# EAGLE design DX (EAGLE 5.07)
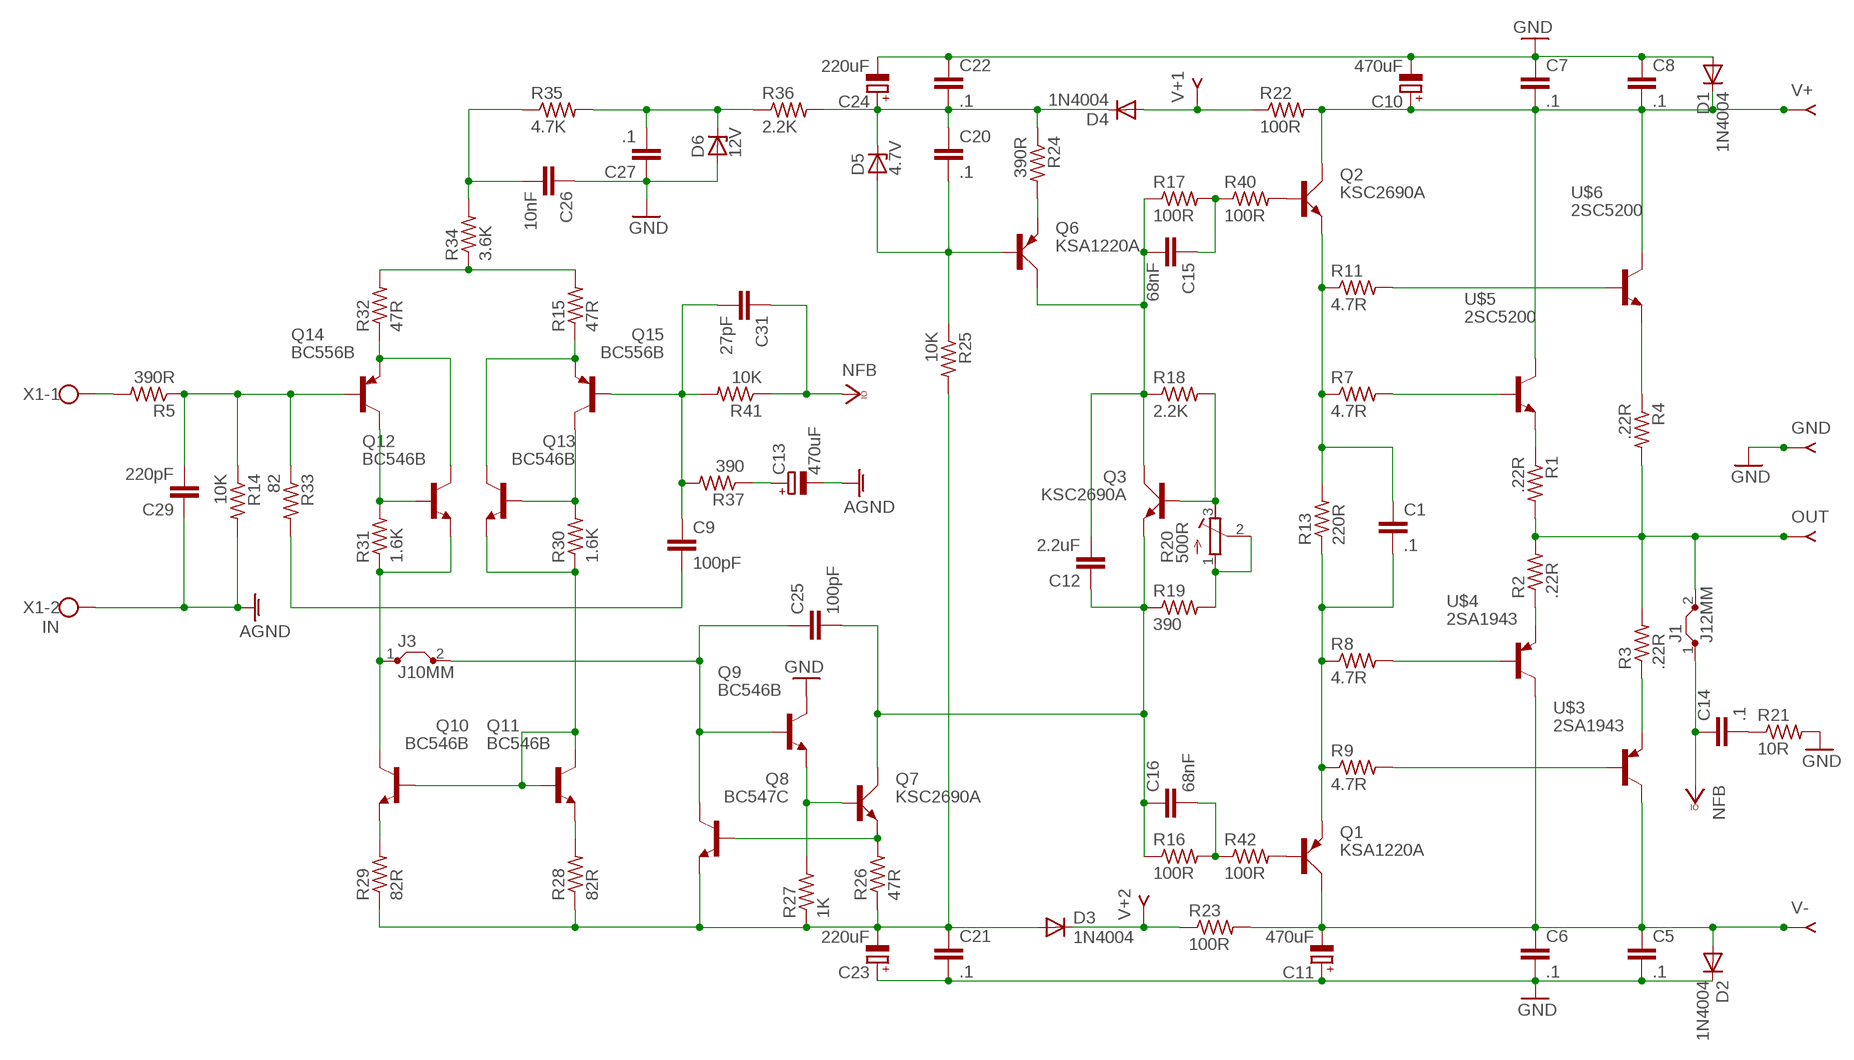
[diagram p0: schematic, sheet 1]

## Parts
C1  .1  C-EU102-043X133  [C102-043X133]
C5  .1  C-EU102-043X133  [C102-043X133]
C6  .1  C-EU102-043X133  [C102-043X133]
C7  .1  C-EU102-043X133  [C102-043X133]
C8  .1  C-EU102-043X133  [C102-043X133]
C9  100pF  C-EU102-043X133  [C102-043X133]
C10  470uF  CPOL-EUE7.5-18  [E7,5-18]
C11  470uF  CPOL-EUE7.5-18  [E7,5-18]
C12  2.2uF  C-EU102-043X133  [C102-043X133]
C13  470uF  CPOL-EUE5-13  [E5-13]
C14  .1  C-EU102-043X133  [C102-043X133]
C15  68nF  C-EU102-043X133  [C102-043X133]
C16  68nF  C-EU102-043X133  [C102-043X133]
C20  .1  C-EU102-043X133  [C102-043X133]
C21  .1  C-EU102-043X133  [C102-043X133]
C22  .1  C-EU102-043X133  [C102-043X133]
C23  220uF  CPOL-EUE5-13  [E5-13]
C24  220uF  CPOL-EUE5-13  [E5-13]
C25  100pF  C-EU102-043X133  [C102-043X133]
C26  10nF  C-EU050-030X075  [C050-030X075]
C27  .1  C-EU102-043X133  [C102-043X133]
C29  220pF  C-EU050-030X075  [C050-030X075]
C31  27pF  C-EU102-043X133  [C102-043X133]
D1  1N4004  [DO41-10]
D2  1N4004  [DO41-10]
D3  1N4004  [DO41-10]
D4  1N4004  [DO41-10]
D5  4.7V  BZX90  [DO34Z7]
D6  12V  BZX90  [DO34Z7]
GND  GND  QFIT  [FASTON]
J1  J12MM  [12]
J3  J10MM  [10]
OUT  QFIT  [FASTON]
Q1  KSA1220A  BD140  [TO126AV]
Q2  KSC2690A  BD139  [TO126AV]
Q3  KSC2690A  BD139  [TO126AV]
Q6  KSA1220A  BD140  [TO126AV]
Q7  KSC2690A  BD139  [TO126AV]
Q8  BC547C  BC547B-NPN-TO92-EBC  [TO92-EBC]
Q9  BC546B  BC546A  [TO92-EBC]
Q10  BC546B  BC546A  [TO92-EBC]
Q11  BC546B  BC546A  [TO92-EBC]
Q12  BC546B  BC546A  [TO92-EBC]
Q13  BC546B  BC546A  [TO92-EBC]
Q14  BC556B  BC556  [TO92-EBC]
Q15  BC556B  BC556  [TO92-EBC]
R1  .22R  R-US_0617/22  [0617/22]
R2  .22R  R-US_0617/22  [0617/22]
R3  .22R  R-US_0617/22  [0617/22]
R4  .22R  R-US_0617/22  [0617/22]
R5  390R  R-US_0309/12  [0309/12]
R7  4.7R  R-US_0309/12  [0309/12]
R8  4.7R  R-US_0309/12  [0309/12]
R9  4.7R  R-US_0309/12  [0309/12]
R11  4.7R  R-US_0309/12  [0309/12]
R13  220R  R-US_0309/12  [0309/12]
R14  10K  R-US_0309/12  [0309/12]
R15  47R  R-US_0309/12  [0309/12]
R16  100R  R-US_0309/12  [0309/12]
R17  100R  R-US_0309/12  [0309/12]
R18  2.2K  R-US_0309/12  [0309/12]
R19  390  R-US_0309/12  [0309/12]
R20  500R  R-TRIMM3299W  [RTRIM3299W]
R21  10R  R-US_0309/12  [0309/12]
R22  100R  R-US_0309/12  [0309/12]
R23  100R  R-US_0309/12  [0309/12]
R24  390R  R-US_0309/12  [0309/12]
R25  10K  R-US_0617/22  [0617/22]
R26  47R  R-US_0309/12  [0309/12]
R27  1K  R-US_0309/12  [0309/12]
R28  82R  R-US_0309/12  [0309/12]
R29  82R  R-US_0309/12  [0309/12]
R30  1.6K  R-US_0309/12  [0309/12]
R31  1.6K  R-US_0309/12  [0309/12]
R32  47R  R-US_0309/12  [0309/12]
R33  82  R-US_0309/12  [0309/12]
R34  3.6K  R-US_0309/12  [0309/12]
R35  4.7K  R-US_0309/12  [0309/12]
R36  2.2K  R-US_0309/12  [0309/12]
R37  390  R-US_0309/12  [0309/12]
R40  100R  R-US_0309/12  [0309/12]
R41  10K  R-US_0309/12  [0309/12]
R42  100R  R-US_0309/12  [0309/12]
U$3  2SA1943  MJL4302  [TO-264]
U$4  2SA1943  MJL4302  [TO-264]
U$5  2SC5200  MJL4281  [TO-264]
U$6  2SC5200  MJL4281  [TO-264]
V+  QFIT  [FASTON]
V+1  QFIT  [FASTON]
V+2  QFIT  [FASTON]
V-  QFIT  [FASTON]
X1  IN  W237-102  [W237-102]

## Nets
AGND: C13.- C29.1 R14.2 X1.2
GND: C5.2 C6.2 C7.1 C8.1 C10.- C11.+ C21.2 C22.1 C23.+ C24.- C26.1 C27.1 D1.A D2.C D6.A GND.1 GND.2 Q9.C R21.2
N$1: R1.1 U$5.E
N$2: R2.1 U$4.E
N$3: R3.1 U$3.E
N$4: R4.1 U$6.E
N$5: R11.2 U$6.B
N$6: C15.1 R17.2 R40.1
N$7: R7.2 U$5.B
N$8: R8.2 U$4.B
N$9: R9.2 U$3.B
N$10: Q2.B R40.2
N$11: D3.C R23.1 V+2.1 V+2.2
N$12: D4.A R22.1 V+1.1 V+1.2
N$15: C12.1 C16.1 C25.2 Q3.E Q7.C R16.1 R19.1
N$16: C9.2 R33.2
N$17: C29.2 Q14.B R5.1 R14.1 R33.1
N$18: C1.2 Q1.E R8.1 R9.1 R13.1
N$19: C1.1 Q2.E R7.1 R11.1 R13.2
N$20: R5.2 X1.1
N$21: R19.2 R20.1(E) R20.2(S)
N$25: Q3.B R18.2 R20.3(A)
N$28: C7.2 C8.2 C10.+ D1.C Q2.C R22.2 U$5.C U$6.C V+.1 V+.2
N$30: C20.2 D5.A Q6.B R25.1
N$31: C12.2 C15.2 Q3.C Q6.C R17.1 R18.1
N$34: C21.1 C23.- D3.A Q8.E R25.2 R26.1 R27.1 R28.1 R29.1
N$35: C20.1 C22.2 C24.+ D4.C D5.C R24.1 R36.2
N$36: Q6.E R24.2
N$38: Q11.E R28.2
N$39: C26.2 R34.2 R35.1
N$40: Q7.B Q9.E R27.2
N$41: Q7.E Q8.B R26.2
N$42: C25.1 J3.2 Q8.C Q9.B
N$43: Q10.E R29.2
N$44: Q13.C Q15.E R15.1
N$45: Q12.B Q14.C R31.2
N$46: Q10.B Q11.B Q11.C Q13.E R30.1
N$47: Q12.C Q14.E R32.1
N$48: J1.2 OUT.1 OUT.2 R1.2 R2.2 R3.2 R4.2
N$49: R15.2 R32.2 R34.1
N$51: C27.2 D6.C R35.2 R36.1
N$52: C5.1 C6.1 C11.- D2.A Q1.C R23.2 U$3.C U$4.C V-.1 V-.2
N$53: C13.+ R37.1
N$54: Q13.B Q15.C R30.2
N$55: C9.1 C31.2 Q15.B R37.2 R41.2
N$58: C14.2 R21.1
N$59: C16.2 R16.2 R42.1
N$60: J3.1 Q10.C Q12.E R31.1
N$61: Q1.B R42.2
VCCIO: C14.1 C31.1 J1.1 R41.1 ; supply symbol labelled NFB

## Library data of the parts
C1 C5-C9 C12 C14-C16 C20-C22 C25-C27 C29 C31 = resistor:C-EU: CAPACITOR, European symbol
C10 C11 C13 C23 C24 = resistor:CPOL-EU: POLARIZED CAPACITOR, European symbol
D1-D4 = diode:1N4004: DIODE general purpose rectifier, 1 A
D5 D6 = diode:BZX90: Z DIODE
GND OUT V+ V+1 V+2 V- = keystone:QFIT: QUICKFIT PCB TERMINAL
J1 J3 = jumper:J: Bridge
Q1 Q6 = transistor-power:BD140: PNP TRANSISTOR
Q2 Q3 Q7 = transistor-power:BD139: NPN TRANSISTOR
Q8 = transistor:*-NPN-: NPN Transistror BF959 corrected 2008.03.06
Q9-Q13 = transistor-npn:BC546*: NPN Transistor
Q14 Q15 = transistor-pnp:BC556*: PNP Transistror
R1-R5 R7-R9 R11 R13-R19 R21-R37 R40-R42 = resistor:R-US_: RESISTOR, American symbol
R20 = resistor:R-TRIMM: Trimm resistor
U$3 U$4 = Rudi_TO264:MJL4302: MJL4302 PNP BCE TO-264
U$5 U$6 = Rudi_TO264:MJL4281: MJL4281 NPN BCE TO-264
X1 = con-wago-500:W237-102: WAGO SCREW CLAMP

## Board
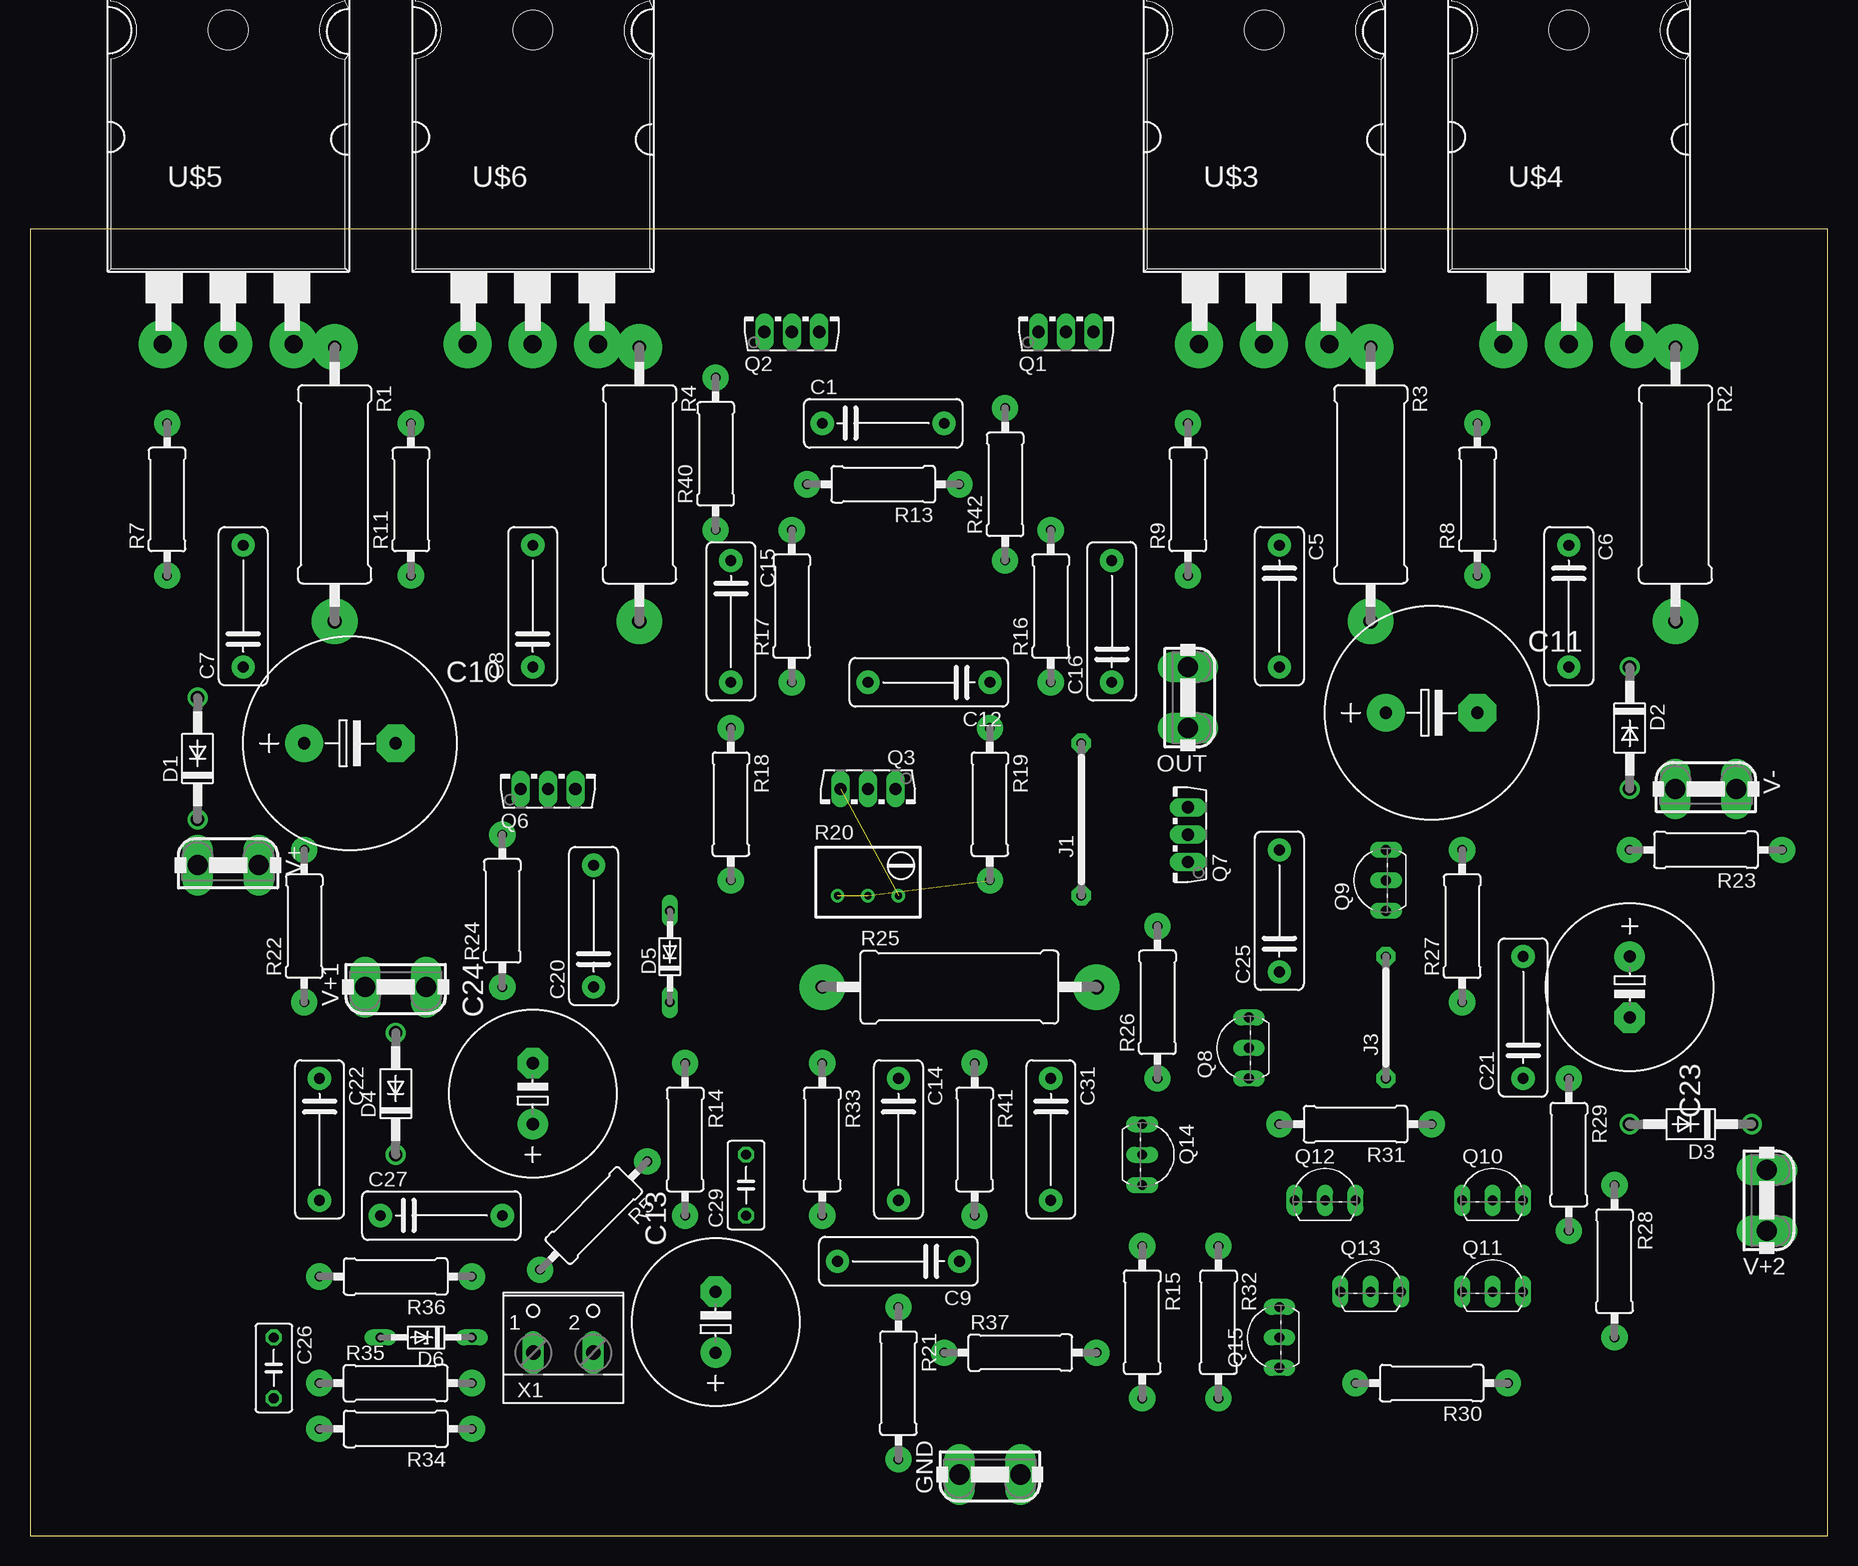
[diagram p1: board, top side]
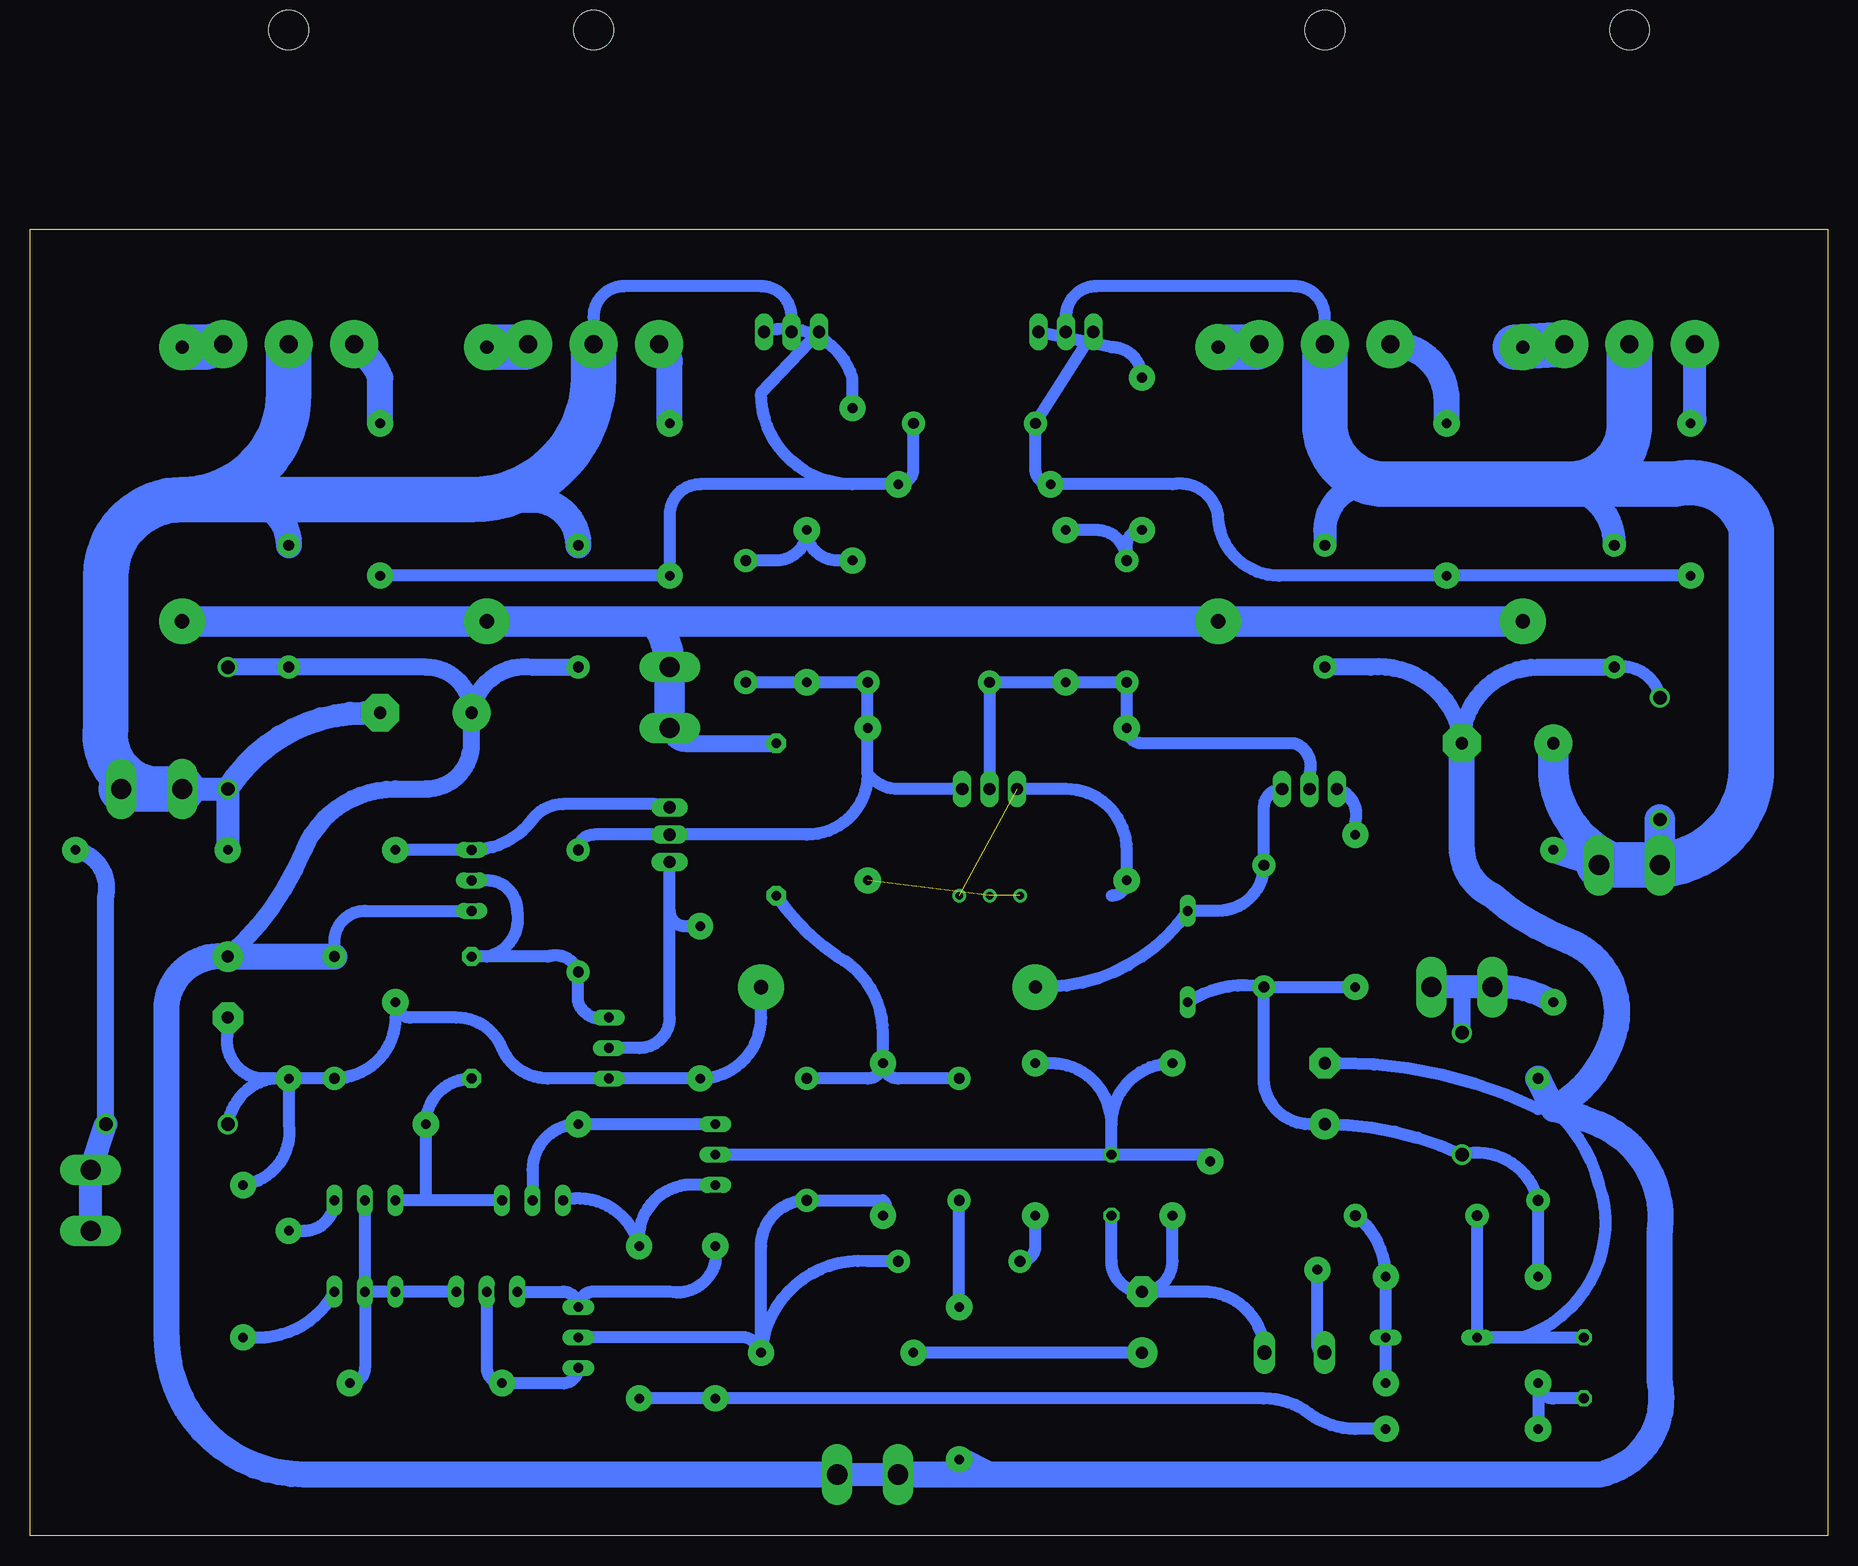
[diagram p2: board, bottom side, seen from below]

Size 149.84 x 108.89 mm. Coordinates in mm from the lower left corner, seen from the top.
Outline: 0,0 149.84,0 149.84,108.89 0,108.89 0,0
Copper layers (1*16): Top 0.035mm / dielectric 1.5mm / Bottom 0.035mm
Design rules "default *": minimum track width 10mil, minimum drill 30mil, track to track 8mil, track to pad 8mil, pad to pad 8mil, via to via 8mil, smd to smd 8mil, copper to edge 40mil, drill to drill 8mil, minimum pad ring 10mil, minimum via ring 8mil, stop-mask expansion 4mil, vias tented up to drill 0mil, thermal gap 10mil
Holes 0.6 mm at -33.02,2.54 -33.02,114.3 180.34,114.3

### Footprints (pad centres in the part's own frame; a part is rotated, then mirrored left to right if it is on the bottom)
C102-043X133 = drill 0.9 pad 1.93 round: 1 -5.08,0; 2 5.08,0
E7,5-18 = drill 1.016 pad 3.15 round: + -3.81,0 | drill 1.016 pad 3.15 octagon: - 3.81,0
E5-13 = drill 1.016 pad 2.54 round: + -2.54,0 | drill 1.016 pad 2.54 octagon: - 2.54,0
C050-030X075 = drill 0.813 octagon: 1 -2.54,0; 2 2.54,0
DO41-10 = drill 1.118 round: A 5.08,0; C -5.08,0
DO34Z7 = drill 0.813 long: A 3.81,0; C -3.81,0
FASTON = drill 1.676 pad 2.54 long: 1 -2.54,0; 2 2.54,0
12 = drill 0.813 pad 1.6 octagon: 1 -6.35,0; 2 6.35,0
10 = drill 0.813 pad 1.6 octagon: 1 -5.08,0; 2 5.08,0
TO126AV = drill 1.016 long: B 2.286,-1.27; C 0,-1.27; E -2.286,-1.27
TO92-EBC = drill 0.813 long: B 0,-1.27; C 2.54,-1.27; E -2.54,-1.27
TO92-EBC' = drill 0.813 long: B 0,-1.27; C -2.54,-1.27; E 2.54,-1.27
0617/22 = drill 1.1 pad 3.81 round: 1 -11.43,0 | drill 1.2 pad 3.81 round: 2 11.43,0
0309/12 = drill 0.8 pad 2.184 round: 1 -6.35,0; 2 6.35,0
RTRIM3299W = drill 0.61 round: 1 1.27,-2.54; 2 1.27,0; 3 1.27,2.54
TO-264 = drill 1.5 pad 4 round: B -5.45,-6.096; E 5.45,-6.096 | drill 1.499 pad 4 round: C 0,-6.096 | hole 3.3: 0,20.09
W237-102 = drill 1.194 long: 1 -2.5,-1.27; 2 2.5,-1.27

### Placement (x,y rotation side)
C1  71.12,92.71 0 top
C5  104.14,77.47 270 top
C6  128.27,77.47 270 top
C7  17.78,77.47 90 top
C8  41.91,77.47 90 top
C9  72.39,22.86 180 top
C10  26.67,66.04 0 top
C11  116.84,68.58 0 top
C12  74.93,71.12 180 top
C13  57.15,17.78 90 top
C14  72.39,33.02 270 top
C15  58.42,76.2 270 top
C16  90.17,76.2 90 top
C20  46.99,50.8 90 top
C21  124.46,43.18 90 top
C22  24.13,33.02 270 top
C23  133.35,45.72 270 top
C24  41.91,36.83 90 top
C25  104.14,52.07 90 top
C26  20.32,13.97 270 top
C27  34.29,26.67 0 top
C29  59.69,29.21 90 top
C31  85.09,33.02 270 top
D1  13.97,64.77 90 top
D2  133.35,67.31 270 top
D3  138.43,34.29 180 top
D4  30.48,36.83 90 top
D5  53.34,48.26 90 top
D6  33.02,16.51 180 top
GND  80.01,5.08 0 top
J1  87.63,59.69 90 top
J3  113.03,43.18 90 top
OUT  96.52,69.85 90 top
Q1  86.36,101.6 0 top
Q2  63.5,101.6 0 top
Q3  69.85,60.96 180 top
Q6  43.18,63.5 0 top
Q7  95.25,58.42 90 top
Q8  100.33,40.64 90 top
Q9  BC546B  [TO92-EBC']  111.76,54.61 90 top
Q10  BC546B  [TO92-EBC']  121.92,29.21 0 top
Q11  BC546B  [TO92-EBC']  121.92,21.59 0 top
Q12  BC546B  [TO92-EBC']  107.95,29.21 0 top
Q13  BC546B  [TO92-EBC']  111.76,21.59 0 top
Q14  BC556B  [TO92-EBC']  93.98,31.75 270 top
Q15  BC556B  [TO92-EBC']  102.87,16.51 90 top
R1  25.4,87.63 270 top
R2  137.16,87.63 270 top
R3  111.76,87.63 270 top
R4  50.8,87.63 270 top
R5  46.99,26.67 225.3 top
R7  11.43,86.36 90 top
R8  120.65,86.36 90 top
R9  96.52,86.36 90 top
R11  31.75,86.36 90 top
R13  71.12,87.63 180 top
R14  54.61,33.02 270 top
R15  92.71,17.78 270 top
R16  85.09,77.47 90 top
R17  63.5,77.47 90 top
R18  58.42,60.96 270 top
R19  80.01,60.96 270 top
R20  69.85,54.61 270 top
R21  72.39,12.7 270 top
R22  22.86,50.8 90 top
R23  139.7,57.15 180 top
R24  39.37,52.07 90 top
R25  77.47,45.72 0 top
R26  93.98,44.45 90 top
R27  119.38,50.8 90 top
R28  132.08,22.86 270 top
R29  128.27,31.75 270 top
R30  116.84,12.7 180 top
R31  110.49,34.29 180 top
R32  99.06,17.78 270 top
R33  66.04,33.02 270 top
R34  30.48,8.89 180 top
R35  30.48,12.7 0 top
R36  30.48,21.59 180 top
R37  82.55,15.24 0 top
R40  57.15,90.17 90 top
R41  78.74,33.02 270 top
R42  81.28,87.63 90 top
U$3  102.87,105.41 0 top
U$4  128.27,105.41 0 top
U$5  16.51,105.41 0 top
U$6  41.91,105.41 0 top
V+  16.51,55.88 180 top
V+1  30.48,45.72 0 top
V+2  144.78,27.94 90 top
V-  139.7,62.23 180 top
X1  44.45,16.51 0 top

### Tracks (layer width: path | path; a pad name or v marks a point on that pad's centre or on a via)
AGND
  Bottom 1.016: X1.2 arc-90 52.03,20.32 C13.- | R14.2 54.61,22.86 arc90 C13.- | C29.1 59.69,22.86 arc-90 C13.-
GND
  Bottom 1.016: C7.1 arc90 D1.A | D6.A C27.1 | D6.A 25.4,16.51 arc-90 19.05,29.21 arc-33 22.86,35.56 arc-16 24.13,35.56 arc-26 40.64,39.37 C24.- | D6.A C26.1 | 124.46,49.53 arc90 121.92,52.07 | 121.92,52.07 Q9.C | 124.46,49.53 arc90 121.92,52.07 | C21.2 124.46,49.53
  Bottom 1.422: C7.1 24.13,72.39 arc-90 C10.- arc-90 38.1,72.39 C8.1 | C5.2 107.95,72.39 arc-90 C11.+ | C11.+ arc-90 116.84,72.39 C6.2 D2.C | C11.+ 113.03,66.04 arc90 116.84,62.23 119.38,62.23 arc-67 127,57.15 arc26 C23.+
  Bottom 1.93: GND.1 GND.2
  Bottom 2.184: 69.85,5.08 GND.1 | 69.85,5.08 R21.2 | C10.- 30.48,57.15 arc-62 27.94,53.34 arc-19 21.59,49.53 arc85 17.78,41.91 arc45 22.86,35.56 | 22.86,35.56 arc6 19.05,34.29 arc74 13.97,25.4 13.97,12.7 arc90 19.05,5.08 69.85,5.08 | GND.2 127,5.08 arc90 138.43,16.51 138.43,44.45 arc90 C23.+ C21.2 | 22.86,35.56 C22.1
N$1
  Bottom 3.81: U$5.E 26.02,99.06 R1.1
N$2
  Bottom 3.81: U$4.E 135.24,99.06 R2.1
N$3
  Bottom 3.81: U$3.E 108.57,99.06 R3.1
N$4
  Bottom 3.81: U$6.E 47.61,99.06 R4.1
N$5
  Bottom 2.184: R11.2 31.75,94.6 arc-90 U$6.B
N$6
  Bottom 1.016: R40.1 arc-90 58.42,82.55 C15.1 arc-90 60.96,83.82 R17.2
N$7
  Bottom 1.93: U$5.B 11.06,93.08 arc90 R7.2
N$8
  Bottom 2.184: R8.2 120.65,96.52 arc-53 123.19,99.06 arc-42 U$4.B
N$9
  Bottom 2.184: R9.2 96.52,97.79 arc-61 U$3.B
N$10
  Bottom 1.016: Q2.B 59.69,99.06 arc90 R40.2
N$11
  Bottom 1.422: D3.C 143.51,53.34 arc-90 R23.1
  Bottom 1.93: D3.C V+2.2 V+2.1
N$12
  Bottom 1.422: 30.48,45.72 D4.A
  Bottom 1.93: V+1.2 30.48,45.72 V+1.1 arc37 R22.1
N$15
  Bottom 1.016: C16.1 R16.1 C12.1 R19.1 80.01,63.5 | C25.2 arc90 102.87,58.42 Q7.C 85.09,58.42 arc-90 80.01,63.5 | Q3.E 77.47,62.23 arc53 80.01,63.5
N$16
  Bottom 1.016: R33.2 66.04,24.13 arc90 C9.2
N$17
  Bottom 1.016: R5.1 arc-90 52.02,31.75 58.42,31.75 C29.2 | 59.69,34.29 arc90 R14.1 | C29.2 59.69,34.29 | R33.1 64.77,39.37 arc90 59.69,34.29 | C29.2 Q14.B
N$18
  Bottom 1.016: R8.1 R9.1 96.52,85.09 arc90 93.98,87.63 R13.1 | R13.1 81.28,87.63 arc90 88.9,95.25 Q1.E | R13.1 arc-90 76.2,88.9 C1.2
N$19
  Bottom 1.016: R7.1 R11.1 45.72,80.01 arc90 50.8,85.09 arc-90 54.61,87.63 R13.2 arc90 66.04,88.9 C1.1 Q2.E
N$20
  Bottom 1.016: R5.2 42.52,15.81 arc-90 X1.1
N$21  (2 unrouted)
N$25  (1 unrouted)
  Bottom 1.016: Q3.B 63.5,62.23 arc90 58.42,57.15 R18.2 arc90 59.69,53.34
N$28
  Bottom 1.016: Q2.C 63.5,101.6 arc90 60.96,104.14 44.45,104.14 arc90 41.91,101.6 U$6.C
  Bottom 1.93: 22.86,87.63 arc90 C7.2 | C8.2 41.91,83.82 arc90 38.1,87.63 35.56,87.63
  Bottom 2.184: V+.1 R22.2
  Bottom 2.54: C10.+ 22.86,63.5 arc-90 V+.2 D1.C
  Bottom 3.81: U$6.C 41.91,92.71 arc-90 36.83,87.63 35.56,87.63 22.86,87.63 21.59,87.63 | 21.59,87.63 12.7,87.63 arc90 6.35,83.82 6.35,63.5 arc90 15.24,55.88 | U$5.C 16.51,92.71 arc90 21.59,87.63 | V+.2 15.24,55.88 | 15.24,55.88 V+.1
N$30
  Bottom 1.016: Q6.B arc-90 46.99,60.71 C20.2 arc90 50.8,52.07 D5.A arc53 64.77,45.72 R25.1
N$31
  Bottom 1.016: Q6.C 43.18,63.5 arc-90 44.45,66.04 57.15,66.04 arc90 R18.1 C15.2 R17.1 C12.2 Q3.C
N$34
  Bottom 1.016: R29.1 C21.1 arc-90 119.38,43.18 R27.1 arc-90 118.11,43.18 114.3,43.18 arc67 110.49,40.64 arc-67 106.68,38.1 Q8.E R26.1 arc-90 88.9,43.18 R25.2 | R28.1 arc-90 128.27,34.29 R29.1 | R29.1 130.81,38.1 arc90 133.35,41.91 C23.- | R29.1 arc-90 D3.A
N$35
  Bottom 1.016: C20.1 arc-44 D5.C arc44 C20.1 | C20.1 R24.1 | R36.2 C22.2 arc-90 D4.C arc-25 C24.+ 43.18,34.29 arc90 46.99,38.1 C20.1
N$36
  Bottom 1.016: R24.2 39.37,59.44 arc-90 Q6.E
N$38
  Bottom 1.016: R28.2 130.81,16.51 arc-62 Q11.E
N$39
  Bottom 1.016: R34.2 R35.1 arc-90 22.86,11.43 C26.2
N$40
  Bottom 1.016: R27.2 Q9.E arc-53 107.95,59.69 arc53 105.41,60.96 97.79,60.96 arc23 Q7.B
N$41
  Bottom 1.016: Q8.B 99.06,40.64 arc-90 96.52,43.18 96.52,52.07 | 96.52,52.07 Q7.E | R26.2 95.25,50.8 arc90 96.52,52.07
N$42
  Bottom 1.016: Q9.B 111.76,54.61 arc90 109.22,52.07 arc90 111.76,48.26 | 111.76,48.26 J3.2 | 111.76,48.26 106.68,48.26 arc90 C25.1 104.14,44.45 arc-90 Q8.C
N$43
  Bottom 1.016: R29.2 127,25.4 arc-90 Q10.E
N$44
  Bottom 1.016: R15.1 92.71,22.86 arc90 96.52,20.32 102.87,20.32 arc-90 Q15.E arc-90 105.41,20.32 Q13.C
N$45
  Bottom 1.016: Q14.C R31.2 arc-90 107.95,30.48 Q12.B
N$46
  Bottom 1.016: Q13.E Q11.C Q11.B | Q11.B Q10.B | Q11.B 121.92,13.97 arc90 R30.1
N$47
  Bottom 1.016: Q14.E 95.25,29.21 arc-90 R32.1 arc-90 Q12.C
N$48
  Bottom 1.016: R4.2 49.53,76.2
  Bottom 1.422: J1.2 95.25,66.04 arc90 OUT.1
  Bottom 2.54: R1.2 R4.2 97.79,76.2 | R2.2 R3.2 97.79,76.2 | OUT.1 OUT.2 arc-37 97.79,76.2
N$49
  Bottom 1.016: R32.2 R15.2 46.99,11.43 arc37 43.18,10.16 arc-37 39.37,8.89 R34.1
N$51
  Bottom 1.016: R35.2 D6.C R36.1 arc-53 C27.2
N$52
  Bottom 1.016: Q1.C 86.36,101.6 arc-90 88.9,104.14 100.33,104.14 arc-90 102.87,101.6 U$3.C
  Bottom 1.93: V-.2 D2.A | D2.A R23.2 | C11.- 121.92,68.58 arc-58 D2.A
  Bottom 2.184: 132.08,86.36 arc90 C6.1 | C5.1 arc-90 107.95,86.36 114.3,86.36
  Bottom 3.81: 139.7,62.23 V-.1 | U$3.C 102.87,96.52 arc90 113.03,86.36 114.3,86.36 132.08,86.36 137.16,86.36 | 137.16,86.36 arc-90 143.51,80.01 143.51,67.31 arc-90 139.7,62.23 | 139.7,62.23 V-.2 | U$4.C 128.27,95.25 arc90 137.16,86.36
N$53
  Bottom 1.016: C13.+ R37.1
N$54
  Bottom 1.016: Q15.C arc90 105.41,12.7 R30.2 arc90 111.76,13.97 Q13.B
N$55
  Bottom 1.016: Q15.B 90.17,16.51 arc53 R37.2 | 78.74,27.94 arc90 R41.2 arc-90 78.74,27.94 | C9.1 80.01,22.86 arc-90 R37.2 | 78.74,27.94 C31.2 arc-90 88.9,24.13 R37.2
N$58
  Bottom 1.016: R21.1 C14.2
N$59
  Bottom 1.016: R42.1 82.55,81.28 arc90 R16.2 arc90 87.63,81.28 C16.2
N$60
  Bottom 1.016: Q12.E 116.84,27.94 | 116.84,27.94 Q10.C | J3.1 arc-90 R31.1 116.84,27.94
N$61
  Bottom 1.016: Q1.B arc90 81.28,96.52 R42.2
VCCIO
  Bottom 1.016: C14.1 77.47,38.1 arc90 R41.1 | R41.1 arc90 80.01,38.1 | 80.01,38.1 C31.1 | R41.1 arc90 80.01,38.1 | R41.1 78.74,41.91 arc-62 82.55,48.26 arc21 J1.1